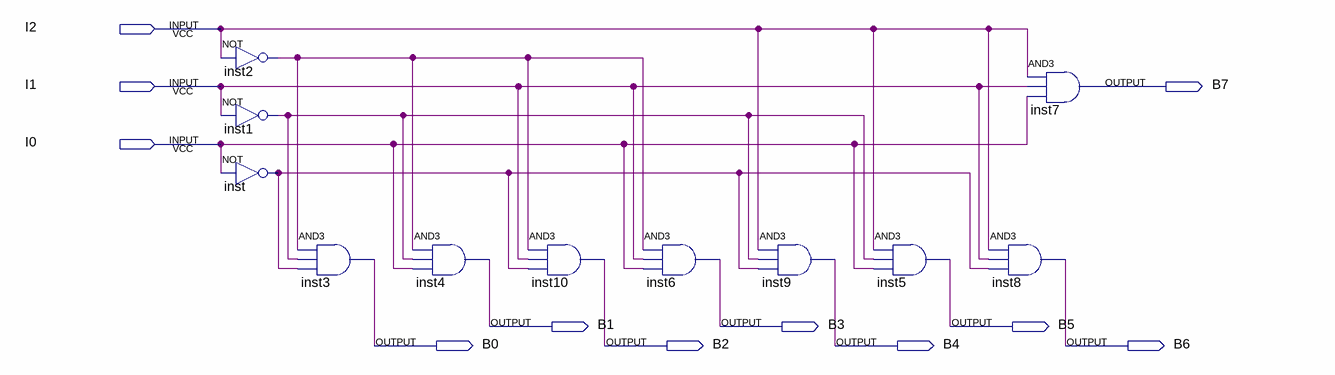
[diagram p0: schematic sheet]
// Quartus schematic Decodificador.bdf as structural Verilog: 11 symbols, 11 pins
module Decodificador (
  input  I2,
  input  I1,
  input  I0,
  output B7,
  output B1,
  output B3,
  output B5,
  output B0,
  output B2,
  output B4,
  output B6
);

  wire inst1_out, inst2_out, inst_out;

  not inst2 (inst2_out, I2);
  not inst1 (inst1_out, I1);
  not inst (inst_out, I0);
  and inst3 (B0, inst2_out, inst1_out, inst_out);
  and inst4 (B1, inst2_out, inst1_out, I0);
  and inst10 (B2, inst2_out, I1, inst_out);
  and inst6 (B3, inst2_out, I1, I0);
  and inst9 (B4, I2, inst1_out, inst_out);
  and inst5 (B5, I2, inst1_out, I0);
  and inst8 (B6, I2, I1, inst_out);
  and inst7 (B7, I2, I1, I0);
endmodule
